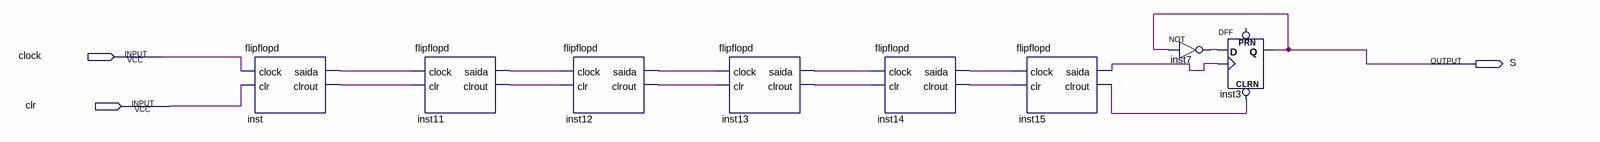
[diagram p0: schematic sheet]
// Quartus schematic DIVISOR_FREQ.bdf as structural Verilog: 8 symbols, 3 pins
module DIVISOR_FREQ (
  input  clock,
  input  clr,
  output S
);

  wire inst7_out, inst11_clrout, inst11_saida, inst12_clrout, inst12_saida, inst13_clrout, inst13_saida,
       inst14_clrout, inst14_saida, inst15_clrout, inst15_saida, inst_clrout, inst_saida;

  flipflopd inst (.clock(clock), .clr(clr), .saida(inst_saida), .clrout(inst_clrout));
  flipflopd inst11 (.clock(inst_saida), .clr(inst_clrout), .saida(inst11_saida), .clrout(inst11_clrout));
  flipflopd inst12 (.clock(inst11_saida), .clr(inst11_clrout), .saida(inst12_saida), .clrout(inst12_clrout));
  flipflopd inst13 (.clock(inst12_saida), .clr(inst12_clrout), .saida(inst13_saida), .clrout(inst13_clrout));
  flipflopd inst14 (.clock(inst13_saida), .clr(inst13_clrout), .saida(inst14_saida), .clrout(inst14_clrout));
  flipflopd inst15 (.clock(inst14_saida), .clr(inst14_clrout), .saida(inst15_saida), .clrout(inst15_clrout));
  not inst7 (inst7_out, S);
  DFF inst3 (.CLRN(inst15_clrout), .CLK(inst15_saida), .D(inst7_out), .Q(S));  // open: PRN
endmodule
